# EAGLE design UBW32_MX460_v262 (EAGLE 7.7.0)
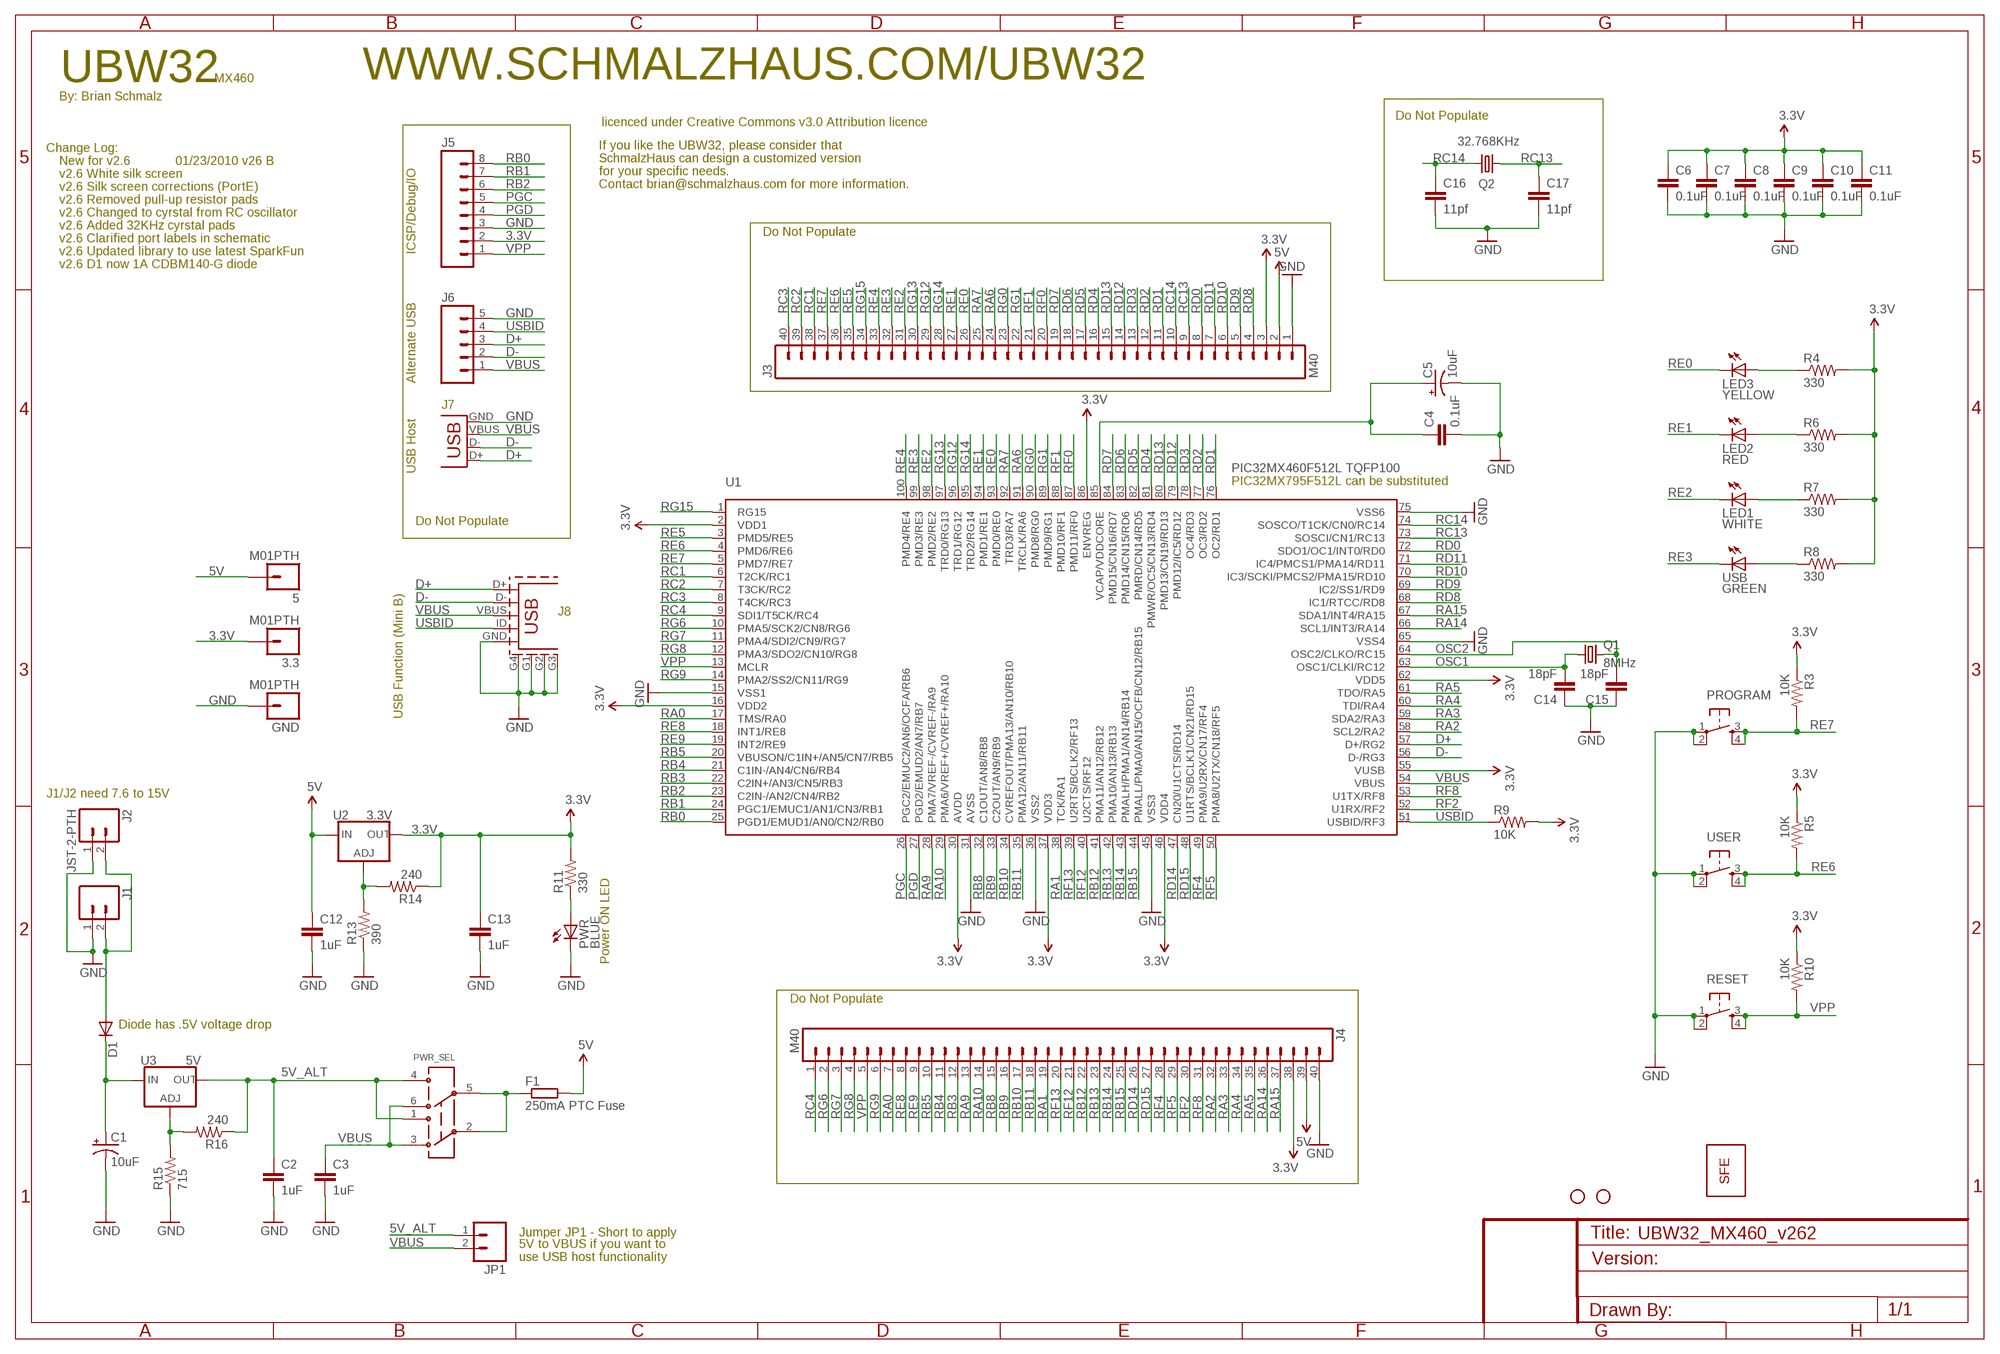
[diagram p0: schematic, sheet 1]

## Parts
3.3  M01PTH  [1X01]
5  M01PTH  [1X01]
C1  10uF  CAP_POL3528  [EIA3528]
C2  1uF  CAP0402-CAP  [0402-CAP]
C3  1uF  CAP0402-CAP  [0402-CAP]
C4  0.1uF  CAP0402-CAP  [0402-CAP]
C5  10uF  CAP_POL3528  [EIA3528]
C6  0.1uF  CAP0402-CAP  [0402-CAP]
C7  0.1uF  CAP0402-CAP  [0402-CAP]
C8  0.1uF  CAP0402-CAP  [0402-CAP]
C9  0.1uF  CAP0402-CAP  [0402-CAP]
C10  0.1uF  CAP0402  [C0402]
C11  0.1uF  CAP0402-CAP  [0402-CAP]
C12  1uF  CAP0402  [C0402]
C13  1uF  CAP0402  [C0402]
C14  18pF  CAP0402-CAP  [0402-CAP]
C15  18pF  CAP0402-CAP  [0402-CAP]
C16  11pf  CAP0402-CAP  [0402-CAP]
C17  11pf  CAP0402-CAP  [0402-CAP]
D1  DIODESMA  [SMA-DIODE]
F1  250mA PTC Fuse  R-EU_R1206  [R1206]
GND  M01PTH  [1X01]
J1  M02PTH  [1X02]
J2  JST-2-PTH  M02-JST-2MM-SMT  [S2B-PH]
J3  M40  [1X40]
J4  M40  [1X40]
J5  M08  [1X08]
J6  M05PTH  [1X05]
J7  USB-A-S  [USB-A-S]
J8  USB-MINIB  USB_5PIN  [USB-MINIB]
JP1  M02PTH  [1X02]
LED1  WHITE  LED0603  [LED-0603]
LED2  RED  LED0603  [LED-0603]
LED3  YELLOW  LED0603  [LED-0603]
PROGRAM  TAC_SWITCHSND  [TACTILE_SWITCH_SMD]
PWR  BLUE  LED0603  [LED-0603]
PWR_SEL  AYZ0202  [AYZ0202]
Q1  8MHz  CRYSTAL5X3  [CRYSTAL-SMD-5X3]
Q2  32.768KHz  CRYSTAL32-SMD  [CRYSTAL-32KHZ-SMD]
R3  10K  RESISTOR0402-RES  [0402-RES]
R4  330  RESISTOR0402-RES  [0402-RES]
R5  10K  RESISTOR0402-RES  [0402-RES]
R6  330  RESISTOR0402-RES  [0402-RES]
R7  330  RESISTOR0402-RES  [0402-RES]
R8  330  RESISTOR0402-RES  [0402-RES]
R9  10K  RESISTOR0402-RES  [0402-RES]
R10  10K  RESISTOR0402-RES  [0402-RES]
R11  330  RESISTOR0402-RES  [0402-RES]
R13  390  RESISTOR0402-RES  [0402-RES]
R14  240  RESISTOR0402-RES  [0402-RES]
R15  715  RESISTOR0402-RES  [0402-RES]
R16  240  RESISTOR0402-RES  [0402-RES]
RESET  TAC_SWITCHSND  [TACTILE_SWITCH_SMD]
U1  PIC32MX460F512L TQFP100  PIC32MX4XXLTQFP100  [TQFP100]
U2  3.3V  V_REG_317SMD  [SOT223]
U3  5V  V_REG_317SMD  [SOT223]
U$4  LOGO-SFENEW  [SFE-NEW-WEBLOGO]
U$6  STAND-OFF  [STAND-OFF]
U$7  STAND-OFF  [STAND-OFF]
USB  GREEN  LED0603  [LED-0603]
USER  TAC_SWITCHSND  [TACTILE_SWITCH_SMD]

## Nets
3.3V: 3.3.1 C6.1 C7.1 C8.1 C9.1 C10.1 C11.1 C13.1 J3.3 J4.38 J5.2 R3.1 R4.2 R5.1 R6.2 R7.2 R8.2 R9.2 R10.1 R11.2 R14.1 U1.2(VDD1) U1.16(VDD2) U1.30(AVDD) U1.37(VDD3) U1.46(VDD4) U1.55(VUSB) U1.62(VDD5) U1.86(ENVREG) U2.2(OUT)
5V: 5.1 C12.1 F1.2 J3.2 J4.39 U2.3(IN)
5V_ALT: C2.1 JP1.1 PWR_SEL.1 PWR_SEL.4 R16.1 U3.2(OUT)
D+: J6.3 J7.D+ J8.D+ U1.57(D+/RG2)
D-: J6.2 J7.D- J8.D- U1.56(D-/RG3)
GND: C1.C(-) C2.2 C3.2 C4.2 C5.C(-) C6.2 C7.2 C8.2 C9.2 C10.2 C11.2 C12.2 C13.2 C14.1 C15.1 C16.2 C17.2 GND.1 J1.1 J2.1 J3.1 J4.40 J5.3 J6.5 J7.GND J8.G1 J8.G2 J8.G3 J8.G4(SHIELD) J8.GND PROGRAM.1 PROGRAM.2 PWR.C R13.1 R15.1 RESET.1 RESET.2 U1.15(VSS1) U1.31(AVSS) U1.36(VSS2) U1.45(VSS3) U1.65(VSS4) U1.75(VSS6) USER.1 USER.2
N$1: D1.A J1.2 J2.2
N$2: F1.1 PWR_SEL.2 PWR_SEL.5
N$3: R13.2 R14.2 U2.1(ADJ)
N$4: R15.2 R16.2 U3.1(ADJ)
N$6: PWR.A R11.1
N$20: R8.1 USB.A
N$22: LED1.A R7.1
N$23: LED2.A R6.1
N$35: LED3.A R4.1
N$110: C4.1 C5.A(+) U1.85(VCAP/VDDCORE)
OSC1: C14.2 Q1.1 U1.63(OSC1/CLKI/RC12)
OSC2: C15.2 Q1.3 U1.64(OSC2/CLKO/RC15)
PGC: J5.5 U1.26(PGC2/EMUC2/AN6/OCFA/RB6)
PGD: J5.4 U1.27(PGD2/EMUD2/AN7/RB7)
RA0: J4.7 U1.17(TMS/RA0)
RA1: J4.19 U1.38(TCK/RA1)
RA2: J4.32 U1.58(SCL2/RA2)
RA3: J4.33 U1.59(SDA2/RA3)
RA4: J4.34 U1.60(TDI/RA4)
RA5: J4.35 U1.61(TDO/RA5)
RA6: J3.24 U1.91(TRCLK/RA6)
RA7: J3.25 U1.92(TRD3/RA7)
RA9: J4.13 U1.28(PMA7/VREF-/CVREF-/RA9)
RA10: J4.14 U1.29(PMA6/VREF+/CVREF+/RA10)
RA14: J4.36 U1.66(SCL1/INT3/RA14)
RA15: J4.37 U1.67(SDA1/INT4/RA15)
RB0: J5.8 U1.25(PGD1/EMUD1/AN0/CN2/RB0)
RB1: J5.7 U1.24(PGC1/EMUC1/AN1/CN3/RB1)
RB2: J5.6 U1.23(C2IN-/AN2/CN4/RB2)
RB3: J4.12 U1.22(C2IN+/AN3/CN5/RB3)
RB4: J4.11 U1.21(C1IN-/AN4/CN6/RB4)
RB5: J4.10 U1.20(VBUSON/C1IN+/AN5/CN7/RB5)
RB8: J4.15 U1.32(C1OUT/AN8/RB8)
RB9: J4.16 U1.33(C2OUT/AN9/RB9)
RB10: J4.17 U1.34(CVREFOUT/PMA13/AN10/RB10)
RB11: J4.18 U1.35(PMA12/AN11/RB11)
RB12: J4.22 U1.41(PMA11/AN12/RB12)
RB13: J4.23 U1.42(PMA10/AN13/RB13)
RB14: J4.24 U1.43(PMALH/PMA1/AN14/RB14)
RB15: J4.25 U1.44(PMALL/PMA0/AN15/OCFB/CN12/RB15)
RC1: J3.38 U1.6(T2CK/RC1)
RC2: J3.39 U1.7(T3CK/RC2)
RC3: J3.40 U1.8(T4CK/RC3)
RC4: J4.1 U1.9(SDI1/T5CK/RC4)
RC13: C17.1 J3.9 Q2.X1 U1.73(SOSCI/CN1/RC13)
RC14: C16.1 J3.10 Q2.X2 U1.74(SOSCO/T1CK/CN0/RC14)
RD0: J3.8 U1.72(SDO1/OC1/INT0/RD0)
RD1: J3.11 U1.76(OC2/RD1)
RD2: J3.12 U1.77(OC3/RD2)
RD3: J3.13 U1.78(OC4/RD3)
RD4: J3.16 U1.81(PMWR/OC5/CN13/RD4)
RD5: J3.17 U1.82(PMRD/CN14/RD5)
RD6: J3.18 U1.83(PMD14/CN15/RD6)
RD7: J3.19 U1.84(PMD15/CN16/RD7)
RD8: J3.4 U1.68(IC1/RTCC/RD8)
RD9: J3.5 U1.69(IC2/SS1/RD9)
RD10: J3.6 U1.70(IC3/SCKI/PMCS2/PMA15/RD10)
RD11: J3.7 U1.71(IC4/PMCS1/PMA14/RD11)
RD12: J3.14 U1.79(PMD12/IC5/RD12)
RD13: J3.15 U1.80(PMD13/CN19/RD13)
RD14: J4.26 U1.47(CN20/U1CTS/RD14)
RD15: J4.27 U1.48(U1RTS/BCLK1/CN21/RD15)
RE0: J3.26 LED3.C U1.93(PMD0/RE0)
RE1: J3.27 LED2.C U1.94(PMD1/RE1)
RE2: J3.31 LED1.C U1.98(PMD2/RE2)
RE3: J3.32 U1.99(PMD3/RE3) USB.C
RE4: J3.33 U1.100(PMD4/RE4)
RE5: J3.35 U1.3(PMD5/RE5)
RE6: J3.36 R5.2 U1.4(PMD6/RE6) USER.3 USER.4
RE7: J3.37 PROGRAM.3 PROGRAM.4 R3.2 U1.5(PMD7/RE7)
RE8: J4.8 U1.18(INT1/RE8)
RE9: J4.9 U1.19(INT2/RE9)
RF0: J3.20 U1.87(PMD11/RF0)
RF1: J3.21 U1.88(PMD10/RF1)
RF2: J4.30 U1.52(U1RX/RF2)
RF4: J4.28 U1.49(PMA9/U2RX/CN17/RF4)
RF5: J4.29 U1.50(PMA8/U2TX/CN18/RF5)
RF8: J4.31 U1.53(U1TX/RF8)
RF12: J4.21 U1.40(U2CTS/RF12)
RF13: J4.20 U1.39(U2RTS/BCLK2/RF13)
RG0: J3.23 U1.90(PMD8/RG0)
RG1: J3.22 U1.89(PMD9/RG1)
RG6: J4.2 U1.10(PMA5/SCK2/CN8/RG6)
RG7: J4.3 U1.11(PMA4/SDI2/CN9/RG7)
RG8: J4.4 U1.12(PMA3/SDO2/CN10/RG8)
RG9: J4.6 U1.14(PMA2/SS2/CN11/RG9)
RG12: J3.29 U1.96(TRD1/RG12)
RG13: J3.30 U1.97(TRD0/RG13)
RG14: J3.28 U1.95(TRD2/RG14)
RG15: J3.34 U1.1(RG15)
USBID: J6.4 J8.ID(USB_ID) R9.1 U1.51(USBID/RF3)
VBUS: C3.1 J6.1 J7.VBUS J8.VBUS JP1.2 PWR_SEL.3 PWR_SEL.6 U1.54(VBUS)
VIN_RAW: C1.A(+) D1.C U3.3(IN)
VPP: J4.5 J5.1 R10.2 RESET.3 RESET.4 U1.13(MCLR)

## Notes on the sheet
- UBW32 | MX460 | WWW.SCHMALZHAUS.COM/UBW32
- By: Brian Schmalz
- Do Not Populate
- licenced under Creative Commons v3.0 Attribution licence
- Change Log: | If you like the UBW32, please consider that
- New for v2.6 | 01/23/2010 v26 B | SchmalzHaus can design a customized version
- v2.6 White silk screen | for your specific needs.
- v2.6 Silk screen corrections (PortE) | Contact brian@schmalzhaus.com for more information.
- v2.6 Removed pull-up resistor pads
- v2.6 Changed to cyrstal from RC oscillator
- v2.6 Added 32KHz cyrstal pads
- Do Not Populate
- v2.6 Clarified port labels in schematic
- v2.6 Updated library to use latest SparkFun | ICSP/Debug/IO
- v2.6 D1 now 1A CDBM140-G diode
- Alternate USB
- J7
- USB Host
- PIC32MX795F512L can be substituted
- Do Not Populate
- J8
- USB Function (Mini B)
- J1/J2 need 7.6 to 15V
- Power ON LED
- Do Not Populate
- Diode has .5V voltage drop
- Jumper JP1 - Short to apply
- 5V to VBUS if you want to
- use USB host functionality

## Library data of the parts
3.3 5 GND = SparkFun-12-01-09:M01: Header 1 Standard 1-pin 0.1" header. Use with straight break away headers (SKU : PRT-00116), right angle break away headers (PRT-00553), swiss pins (PRT-00743), machine pins (PRT-00117), and female headers (PRT-00115).
C1 C5 = SparkFun02-20-08:CAP_POL: Capacitor Polarized These are standard SMD and PTH capacitors. Normally 10uF, 47uF, and 100uF in electrolytic and tantalum varieties. Always verify the external diameter of the through hole cap, it varies with capacity, voltage, and manufacturer. The EIA devices should be standard.
C2-C4 C6-C9 C11 C14-C17 = SparkFun:CAP: Capacitor Standard 0603 ceramic capacitor, and 0.1" leaded capacitor.
C10 C12 C13 = SparkFun02-20-08:CAP: Capacitor Standard 0603 ceramic capacitor, and 0.1" leaded capacitor.
D1 = SparkFun-12-01-09:DIODE: Diode These are standard reverse protection diodes and small signal diodes. SMA package can handle up to about 1A. SOD-323 can handle about 200mA. What the SOD-323 package when ordering, there are some mfgs out there that are 5-pin packages.
F1 = resistor:R-EU_: RESISTOR, European symbol
J1 JP1 = SparkFun-12-01-09:M02: Header 2 Standard 2-pin 0.1" header. Use with straight break away headers (SKU : PRT-00116), right angle break away headers (PRT-00553), swiss pins (PRT-00743), machine pins (PRT-00117), and female headers (PRT-00115). Molex polarized connector foot print use with SKU : PRT-08233 with associated crimp pins and housings.
J2 = SparkFun:M02: Header 2 Standard 2-pin 0.1" header. Use with straight break away headers (SKU : PRT-00116), right angle break away headers (PRT-00553), swiss pins (PRT-00743), machine pins (PRT-00117), and female headers (PRT-00115). Molex polarized connector foot print use with SKU : PRT-08233 with associated crimp pins and housings.
J3 J4 = SchmalzHaus:M40
J5 = SchmalzHaus:M08: Header 8 Standard 8-pin 0.1" header. Use with straight break away headers (SKU : PRT-00116), right angle break away headers (PRT-00553), swiss pins (PRT-00743), machine pins (PRT-00117), and female headers (PRT-00115).
J6 = SparkFun-12-01-09:M05: Header 5 Standard 5-pin 0.1" header. Use with straight break away headers (SKU : PRT-00116), right angle break away headers (PRT-00553), swiss pins (PRT-00743), machine pins (PRT-00117), and female headers (PRT-00115). Molex polarized connector foot print use with SKU : PRT-08230 with associated crimp pins and housings.
J7 = SparkFun02-20-08:USB: USB Connectors USB-B-PTH is fully proven SKU : PRT-00139 USB-miniB is fully proven SKU : PRT-00587 USB-A-PCB is untested. USB-A-H is throughly reviewed, but untested. Spark Fun Electronics SKU : PRT-00437 USB-B-SMT is throughly reviewed, but untested. Needs silkscreen touching up. USB-A-S has not been used/tested USB-MB-H has not been used/tested
J8 = SparkFun02-20-08:USB_5PIN
LED1-LED3 PWR USB = SparkFun:LED: LEDs Standard schematic elements and footprints for 5mm, 3mm, 1206, and 0603 sized LEDs. 5mm - Spark Fun Electronics SKU : COM-00529 (and others)
PROGRAM RESET USER = SparkFun02-20-08:TAC_SWITCH: Momentary Switch Button commonly used for reset or general input. Spark Fun Electronics SKU : COM-00097
PWR_SEL = SparkFun02-20-08:AYZ0202: SPDT Slide Switch Simple SMD single-pull double-throw slide switch. Good for less than 350mA power switch, switching UARTs between devices, etc. Spark Fun Electronics SKU : COM-00597
Q1 = SparkFun11_03_09:CRYSTAL: Crystals Various standard crystals. Proven footprints. Spark Fun Electronics SKU : COM-00534
Q2 = SchmalzHaus:CRYSTAL: Crystals Various standard crystals. Proven footprints. Spark Fun Electronics SKU : COM-00534
R3-R11 R13-R16 = SparkFun:RESISTOR: Resistor Basic schematic elements and footprints for 0603, 1206, and PTH 1/10th watt (small) resistors.
U1 = SchmalzHaus:PIC32MX4XXL
U2 U3 = SparkFun:V_REG_317: Voltage Regulator Standard LM317 adjustable voltage regulator. AOI (Adjust Output Input). Google 'LM317 Calculator' for easy to use app to get the two resistor values needed. 240/720 for 5V output. 240/390 for 3.3V output. Spark Fun Electronics SKU : COM-00527
U$4 = SparkFun02-20-08:LOGO-SFE: Spark Fun Electronics PCB Logo This is the standard Spark Fun Electronics PCB logo.
U$6 U$7 = SparkFun02-20-08:STAND-OFF: Stand Off This is the mechanical footprint for a #4 phillips button head screw. Use the keepout ring to avoid running the screw head into surrounding components. SKU : PRT-00447

## Board
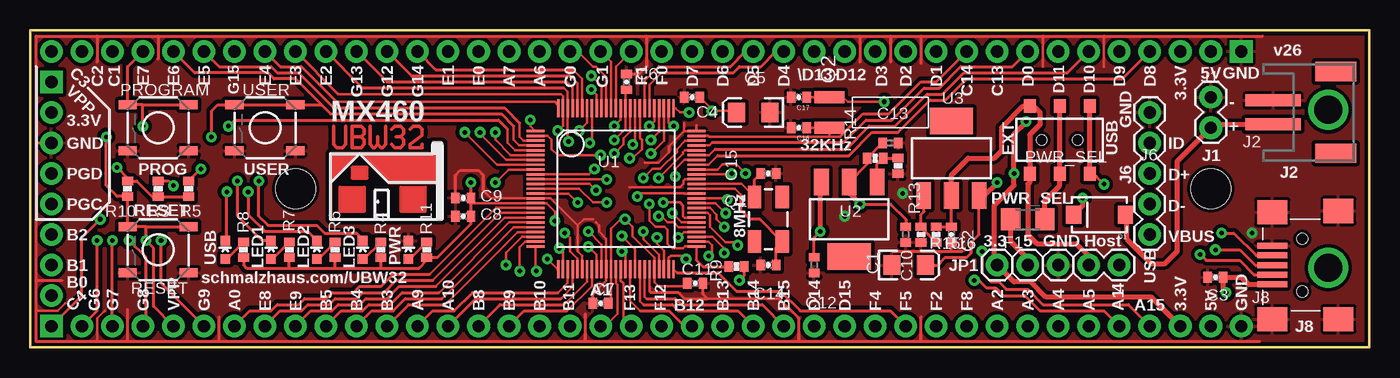
[diagram p1: board, top side]
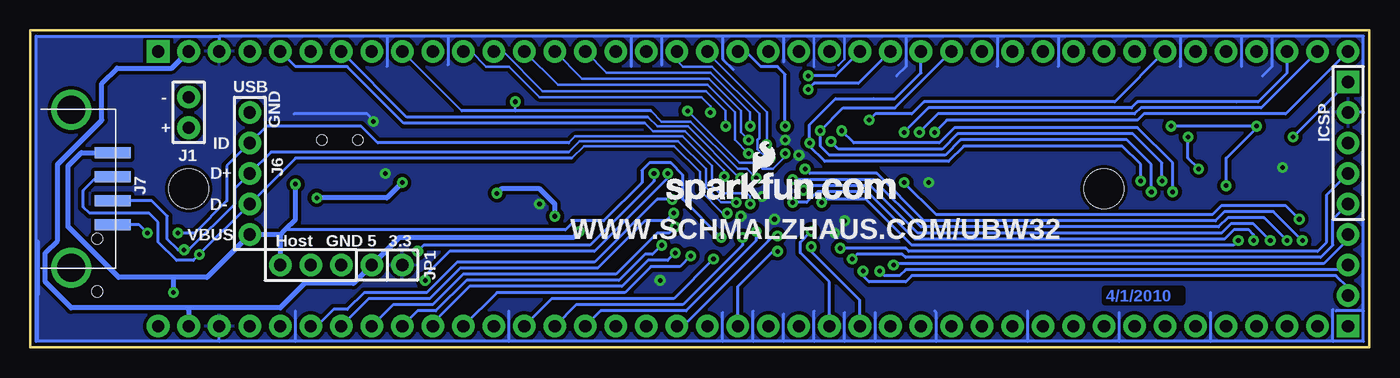
[diagram p2: board, bottom side, seen from below]

Size 111.51 x 26.42 mm. Coordinates in mm from the lower left corner, seen from the top.
Outline: 0,26.42 111.51,26.42 111.51,0 0,0 0,26.42
Copper layers (1*16): Top 0.035mm / dielectric 1.5mm / Bottom 0.035mm
Design rules "SparkFun *": minimum track width 8mil, minimum drill 15mil, track to track 8mil, track to pad 8mil, pad to pad 8mil, via to via 8mil, smd to smd 8mil, copper to edge 8mil, drill to drill 8mil, minimum pad ring 12mil, minimum via ring 10mil, stop-mask expansion 4mil, vias tented up to drill 20mil, thermal gap 10mil

### Footprints (pad centres in the part's own frame; a part is rotated, then mirrored left to right if it is on the bottom)
1X01 = drill 1.016 pad 1.88: 1 0,0
EIA3216 = smd 1.4 x 1.6: A 1.4,0; C -1.4,0
0402-CAP = smd 0.7 x 0.9: 1 -0.65,0; 2 0.65,0
C0402 = smd 0.7 x 0.9: 1 -0.65,0; 2 0.65,0
SMA-DIODE = smd 1.27 x 1.47: A -2.15,0; C 2.15,0
R1206 = smd 1.6 x 1.803: 1 -1.422,0; 2 1.422,0
1X02 = drill 1.016 pad 1.88: 1 0,0; 2 2.54,0
S2B-PH = smd 1 x 4.6: 1 -1,-3.7; 2 1,-3.7 | smd 1.6 x 3.4: NC1 -3.4,1.5; NC2 3.4,1.5
1X40 = drill 1.016 pad 1.88 square: 1 -49.53,0 | drill 1.016 pad 1.88: 2 -46.99,0; 3 -44.45,0; 4 -41.91,0; 5 -39.37,0; 6 -36.83,0; 7 -34.29,0; 8 -31.75,0; 9 -29.21,0; 10 -26.67,0; 11 -24.13,0; 12 -21.59,0; 13 -19.05,0; 14 -16.51,0; 15 -13.97,0; 16 -11.43,0; 17 -8.89,0; 18 -6.35,0; 19 -3.81,0; 20 -1.27,0; 21 1.27,0; 22 3.81,0; 23 6.35,0; 24 8.89,0; 25 11.43,0; 26 13.97,0; 27 16.51,0; 28 19.05,0; 29 21.59,0; 30 24.13,0; 31 26.67,0; 32 29.21,0; 33 31.75,0; 34 34.29,0; 35 36.83,0; 36 39.37,0; 37 41.91,0; 38 44.45,0; 39 46.99,0; 40 49.53,0
1X08 = drill 1.016 pad 1.88 square: 1 0,0 | drill 1.016 pad 1.88: 2 2.54,0; 3 5.08,0; 4 7.62,0; 5 10.16,0; 6 12.7,0; 7 15.24,0; 8 17.78,0
1X05 = drill 1.016 pad 1.88: 1 0,0; 2 2.54,0; 3 5.08,0; 4 7.62,0; 5 10.16,0
USB-A-S = smd 3 x 0.9: D+ 3.45,-1; D- 3.45,1; GND 3.45,-3; VBUS 3.45,3 | drill 2.311: P$5 0,-6.566; P$6 0,6.566
USB-MINIB = smd 2.5 x 0.5: D+ 2.5,0; D- 2.5,0.8; GND 2.5,-1.6; ID 2.5,-0.8; VBUS 2.5,1.6 | smd 2.5 x 2: G1 -3,4.5; G2 2.5,4.5; G3 -3,-4.5; G4 2.5,-4.4 | hole 0.9: 0,2.2; 0,-2.2
LED-0603 = smd 0.8 x 0.8: A 0,-0.75; C 0,0.75
TACTILE_SWITCH_SMD = smd 1.524 x 0.762: 1 -2.54,1.905; 2 2.54,1.905; 3 -2.54,-1.905; 4 2.54,-1.905
AYZ0202 = smd 1 x 1.15: 1 -2.5,2.825; 2 0,2.825; 3 2.5,2.825; 4 -2.5,-2.825; 5 0,-2.825; 6 2.5,-2.825 | hole 0.85: 1.5,0; -1.5,0
CRYSTAL-SMD-5X3 = smd 1.9 x 1.1: 1 -1.85,-1.15; 2 1.85,-1.15; 3 1.85,1.15; 4 -1.85,1.15
CRYSTAL-32KHZ-SMD = smd 1 x 2.5: X1 -1.27,0; X2 1.27,0
0402-RES = smd 0.7 x 0.9: 1 -0.65,0; 2 0.65,0
TQFP100 = smd 0.2 x 1.5: 1 -4.8,-6.7; 2 -4.4,-6.7; 3 -4,-6.7; 4 -3.6,-6.7; 5 -3.2,-6.7; 6 -2.8,-6.7; 7 -2.4,-6.7; 8 -2,-6.7; 9 -1.6,-6.7; 10 -1.2,-6.7; 11 -0.8,-6.7; 12 -0.4,-6.7; 13 0,-6.7; 14 0.4,-6.7; 15 0.8,-6.7; 16 1.2,-6.7; 17 1.6,-6.7; 18 2,-6.7; 19 2.4,-6.7; 20 2.8,-6.7; 21 3.2,-6.7; 22 3.6,-6.7; 23 4,-6.7; 24 4.4,-6.7; 25 4.8,-6.7; 51 4.8,6.7; 52 4.4,6.7; 53 4,6.7; 54 3.6,6.7; 55 3.2,6.7; 56 2.8,6.7; 57 2.4,6.7; 58 2,6.7; 59 1.6,6.7; 60 1.2,6.7; 61 0.8,6.7; 62 0.4,6.7; 63 0,6.7; 64 -0.4,6.7; 65 -0.8,6.7; 66 -1.2,6.7; 67 -1.6,6.7; 68 -2,6.7; 69 -2.4,6.7; 70 -2.8,6.7; 71 -3.2,6.7; 72 -3.6,6.7; 73 -4,6.7; 74 -4.4,6.7; 75 -4.8,6.7 | smd 1.5 x 0.2: 26 6.7,-4.8; 27 6.7,-4.4; 28 6.7,-4; 29 6.7,-3.6; 30 6.7,-3.2; 31 6.7,-2.8; 32 6.7,-2.4; 33 6.7,-2; 34 6.7,-1.6; 35 6.7,-1.2; 36 6.7,-0.8; 37 6.7,-0.4; 38 6.7,0; 39 6.7,0.4; 40 6.7,0.8; 41 6.7,1.2; 42 6.7,1.6; 43 6.7,2; 44 6.7,2.4; 45 6.7,2.8; 46 6.7,3.2; 47 6.7,3.6; 48 6.7,4; 49 6.7,4.4; 50 6.7,4.8; 76 -6.7,4.8; 77 -6.7,4.4; 78 -6.7,4; 79 -6.7,3.6; 80 -6.7,3.2; 81 -6.7,2.8; 82 -6.7,2.4; 83 -6.7,2; 84 -6.7,1.6; 85 -6.7,1.2; 86 -6.7,0.8; 87 -6.7,0.4; 88 -6.7,0; 89 -6.7,-0.4; 90 -6.7,-0.8; 91 -6.7,-1.2; 92 -6.7,-1.6; 93 -6.7,-2; 94 -6.7,-2.4; 95 -6.7,-2.8; 96 -6.7,-3.2; 97 -6.7,-3.6; 98 -6.7,-4; 99 -6.7,-4.4; 100 -6.7,-4.8
SOT223 = smd 1.219 x 2.235: 1 -2.311,-3.099; 2 0,-3.099; 3 2.311,-3.099 | smd 3.6 x 2.2: 4 0,3.099
STAND-OFF = hole 3.302: 0,0

### Placement (x,y rotation side)
3.3  80.52,6.86 0 top
5  83.06,6.86 0 top
C1  10uF  [EIA3216]  73.15,6.86 0 top
C2  76.71,9.4 270 top
C3  98.68,5.84 180 top
C4  55.12,20.83 180 top
C5  10uF  [EIA3216]  60.2,19.56 180 top
C6  49.66,22.1 90 top
C7  47.5,3.68 180 top
C8  36.07,10.92 180 top
C9  36.07,12.45 180 top
C10  72.9,9.4 270 top
C11  55.37,5.33 0 top
C12  65.28,6.86 270 top
C13  71.63,17.02 0 top
C14  61.47,6.86 0 top
C15  61.47,14.48 180 top
C16  64.01,18.29 180 top
C17  64.01,20.83 180 top
D1  89.03,11.05 180 top
F1  83.06,10.67 180 top
GND  85.6,6.86 0 top
J1  98.3,20.83 270 top
J2  107.19,19.56 270 top
J3  51.31,24.64 180 top
J4  51.31,1.78 0 top
J5  1.78,22.1 270 top
J6  93.22,9.4 90 top
J7  108.08,13.21 0 bottom
J8  105.92,6.86 180 top
JP1  88.14,6.86 0 top
LED1  20.07,8.13 0 top
LED2  23.88,8.13 0 top
LED3  27.69,8.13 0 top
PROGRAM  10.67,18.29 180 top
PWR  31.5,8.13 0 top
PWR_SEL  85.72,17.27 0 top
Q1  61.47,10.67 90 top
Q2  66.55,19.56 270 top
R3  10.67,13.21 90 top
R4  29.21,8.13 270 top
R5  13.21,13.21 90 top
R6  25.4,8.13 270 top
R7  21.59,8.13 270 top
R8  17.78,8.13 270 top
R9  58.8,6.73 0 top
R10  8.13,13.21 270 top
R11  33.02,8.13 270 top
R13  72.26,15.11 90 top
R14  70.36,15.75 0 top
R15  74.17,9.4 90 top
R16  75.44,9.4 270 top
RESET  10.67,8.13 180 top
U1  48.77,13.21 270 top
U2  68.2,10.67 180 top
U3  76.71,15.75 0 top
U$3  [UBW32]  29.59,17.91 0 top
U$4  58.55,11.43 0 bottom
U$5  [SCHMALZHAUS]  28.83,13.21 0 top
U$6  98.3,13.21 0 top
U$7  22.1,13.21 0 top
USB  16.26,8.13 0 top
USER  19.56,18.29 180 top

### Tracks (layer width: path | path; a pad name or v marks a point on that pad's centre or on a via)
3.3V  (via drill 0.38)
  Top 0.203: v48.64,17.27 49.57,18.2 U1.86 49.57,21.36 arc-90 C6.1 | v43.69,10.54 43.69,11.3 42.98,12.01 U1.16 36.77,12.01 | v44.51,9.52 44.58,9.52 44.96,9.14 44.96,8 45.57,7.39 U1.30 | U1.2 43.1,17.61 43.43,17.27 43.43,16.51 43.94,16 v47.5,16 | 48.37,3.92 U1.37 48.37,9.89 49.15,10.67 v49.53,10.67 50.16,10.03 50.16,9.27 51.97,7.47 U1.46 51.97,5.44 52.32,5.08 54.48,5.08 54.74,5.33 C11.1 | U1.62 54.5,12.81 54.48,12.83 50.8,12.83 v50.55,12.57 | U1.55 54,10.01 53.59,10.41 53.09,10.41 52.58,10.92 v52.32,10.92
  Top 0.254: v36.7,13.72 36.72,13.7 C9.1 36.7,12.45 36.7,11.94 | 36.7,10.92 C8.1 | 36.7,10.92 36.7,11.94 | 36.7,11.94 36.77,12.01 | 36.7,10.92 36.7,10.29 33.91,7.49 33.02,7.49 R11.2 33.02,7.24 32.38,6.6 29.21,6.6 | 21.59,6.6 25.4,6.6 | 25.4,6.6 29.21,6.6 | 29.21,6.6 R4.2 | 25.4,6.6 R6.2 | 21.59,6.6 R7.2 | R8.2 17.78,6.87 18.05,6.6 21.59,6.6 | C7.1 48.13,3.68 48.37,3.92 | R5.1 R3.1 10.18,12.56 8.89,13.84 8.14,13.84 R10.1 8.13,14.1 v7.24,14.99 | C13.1 R14.1 69.71,15.28 U2.2 | 72.88,10.03 C10.1 72.9,10.67 71.63,11.94 v69.09,11.94 | R9.2 59.45,5.98 v59.05,5.59
  Top 0.406: J4.38 93.34,4.19 84.58,4.19 83.31,5.46 81.91,5.46 3.3.1 80.26,7.11 80.26,11.81 81.91,13.46 v81.91,14.48 81.91,17.78 v82.93,18.8 | v69.09,11.94 68.2,12.83 U2.2
  Bottom 0.203: 43.69,25.91 43.69,24 44.2,23.49 | 46.23,25.91 46.23,23.37
  Bottom 0.254: 89.53,19.43 83.44,19.43 82.93,18.92 v82.93,18.8 | 0.51,3.05 0.51,0.51 3.05,0.51 | 0.51,3.05 0.51,19.56 | 0.51,19.56 0.51,25.91 8.13,25.91 | 8.13,25.91 10.67,25.91 | 10.67,25.91 15.75,25.91 | 15.75,25.91 25.91,25.91 | 25.91,25.91 30.99,25.91 | 30.99,25.91 38.61,25.91 | 38.61,25.91 43.69,25.91 46.23,25.91 48.77,25.91 | 48.77,25.91 53.85,25.91 | 81.79,25.91 95.76,25.91 | 76.71,25.91 81.79,25.91 | 61.47,25.91 76.71,25.91 | 58.93,25.91 61.47,25.91 | 53.85,25.91 58.93,25.91 | 95.76,25.91 111,25.91 111,0.51 | 3.05,0.51 13.21,0.51 | 13.21,0.51 20.83,0.51 | 20.83,0.51 28.45,0.51 | 28.45,0.51 36.07,0.51 | 36.07,0.51 41.15,0.51 | 41.15,0.51 43.69,0.51 | 43.69,0.51 46.23,0.51 | 46.23,0.51 48.77,0.51 | 48.77,0.51 51.31,0.51 | 51.31,0.51 53.85,0.51 | 53.85,0.51 71.63,0.51 | 71.63,0.51 89.41,0.51 | 89.41,0.51 95.76,0.51 | 95.76,0.51 111,0.51 | 0.51,19.56 2.03,19.56 | 0.51,3.05 2.79,3.05 | 3.05,0.51 3.05,3.17 | 41.15,0.51 41.15,2.92 | 48.77,0.51 48.77,2.79 | 53.85,25.91 53.85,24 52.96,23.11 | 95.76,25.91 95.76,24.13 | 95.76,0.51 J4.38 | 89.41,0.51 89.41,3.05 | 25.91,25.91 25.91,23.37 | 30.99,25.91 30.99,23.37 | 48.77,25.91 48.77,23.75 | 38.61,25.91 38.61,23.37 39.37,22.61 | 15.75,25.91 15.75,23.37 | 10.67,25.91 10.67,23.37 | 8.13,25.91 8.13,23.37 8.89,22.61 | 13.21,0.51 13.21,2.92 | 20.83,0.51 20.83,2.92 | 28.45,0.51 28.45,3.05 | 36.07,0.51 36.07,2.92 36.2,3.05 | 43.69,0.51 43.69,2.92 | 53.85,0.51 53.85,2.92 | 51.31,0.51 51.31,3.05 | 46.23,0.51 46.23,3.05 | 71.63,0.51 71.63,3.05 | 76.71,25.91 76.71,23.49 | 81.79,25.91 81.79,23.37 | 58.93,25.91 58.93,23.49 | 61.47,25.91 61.47,23.37 | 110.87,4.45 110.87,0.64 111,0.51
  Bottom 0.406: 110.87,4.45 110.87,8.76
  pour Bottom (isolate 0.305): 0.51,0.51 0.51,25.91 111,25.91 111,0.51
5V  (via drill 0.38)
  Top 0.254: C12.1 65.28,9.14 v65.79,9.65
  Top 0.406: F1.2 81.64,8.79 83.06,7.37 5.1 | U2.3 65.79,13.66 v65.79,9.65
  Bottom 0.254: 98.42,3.3 98.3,3.17
  Bottom 0.406: v65.79,9.65 66.29,9.14 80.77,9.14 5.1 84.58,5.33 88.65,5.33 90.68,3.3 98.42,3.3 108.08,3.3 110.24,5.46 110.24,7.87 109.22,8.89 109.22,15.24 105.54,18.92 105.54,21.97 104.27,23.24 99.69,23.24 J3.2 | 98.3,3.17 J4.39
5V_ALT
  Top 0.254: 76.71,12.57 U3.2 C2.1 R16.1
  Top 0.406: JP1.1 88.14,7.62 87.12,8.64 83.82,8.64 83.06,9.4 83.06,13.59 83.22,13.76 PWR_SEL.4 83.22,17.69 84.07,18.54 84.07,19.56 83.53,20.1 PWR_SEL.1 82.71,20.1 80.9,18.29 80.9,16.38 80.26,15.75 78.1,15.75 76.71,14.35 U3.2
D+  (via drill 0.38)
  Top 0.203: U1.57 54.47,10.81 54.36,10.92 54.36,11.81 54.1,12.07 v52.71,12.07
  Top 0.254: J8.D+ 101.98,6.86 100.71,8.13 v98.68,8.13
  Bottom 0.203: 66.67,16.26 65.76,17.17 57.56,17.17 55.25,14.86 55.25,13.34 53.98,12.07 v52.71,12.07
  Bottom 0.254: 66.67,16.26 91.44,16.26 J6.3 94.49,13.21 94.49,11.94 98.3,8.13 v98.68,8.13 99.19,8.13 100.08,9.02 100.08,10.92 101.36,12.21 J7.D+
D-  (via drill 0.38)
  Top 0.203: U1.56 54.23,10.41 v53.47,11.18
  Top 0.254: v97.41,7.75 97.92,7.24 100.71,7.24 101.89,6.06 J8.D-
  Bottom 0.203: 66.42,15.75 65.41,16.76 61.47,16.76 57.91,16.76 55.75,14.61 55.75,13.08 53.85,11.18 v53.47,11.18
  Bottom 0.254: 66.42,15.75 89.41,15.75 J6.2 v97.41,7.75 97.92,7.24 99.31,7.24 100.84,8.76 100.84,10.41 101.6,11.18 106.55,11.18 107.06,11.68 107.06,13.08 105.93,14.21 J7.D-
GND  (via drill 0.38)
  Top 0.203: 38.1,12.7 38.39,12.41 U1.15 43.35,12.41 45.59,10.16 | 46.86,4.45 47.97,5.55 U1.36 47.97,9.05 47.37,9.65 47.37,10.16 47.12,10.41 | 54.46,18.01 53.21,16.76 53.21,16.26 52.32,15.37 51.18,15.37 | U1.31 45.97,7.63 45.59,8 45.59,10.16 | 45.59,10.16 46.1,10.67 46.86,10.67 | 55.47,18.51 U1.75 54.46,18.01 | U1.65 54.54,14.01 54.39,13.86 54.39,13.63 54.1,13.34 49.91,13.34 | 54.46,18.01 54.46,18.68 | 89.41,25.91 89.41,23.37 | 84.33,25.91 84.33,23.37 | 5.59,0.51 5.59,2.41 6.22,3.05 | 0.51,3.05 2.29,3.05 2.92,3.68 | U1.45 51.57,4.69 51.69,4.57 | 62.36,4.06 54.48,4.06
  Top 0.254: C9.2 35.42,14.34 35.81,14.73 37.34,14.73 37.72,14.35 37.72,13.08 38.1,12.7 | C7.2 46.86,3.68 46.86,4.45 | 51.69,4.57 53.98,4.57 54.48,4.06 56.39,4.06 56.02,4.43 C11.2 | C6.2 50.69,22.75 51.31,23.37 51.31,25.91 | 51.31,25.91 69.09,25.91 | 69.09,25.91 69.09,23.75 | 5.59,25.91 0.51,25.91 0.51,17.02 | 5.59,25.91 10.67,25.91 | 10.67,25.91 51.31,25.91 | 0.51,5.59 0.51,3.05 0.51,0.51 5.59,0.51 8.13,0.51 | 0.51,5.59 0.51,17.02 | 8.13,0.51 15.75,0.51 | 15.75,0.51 46.23,0.51 | 46.23,0.51 64.01,0.51 | 64.01,0.51 74.17,0.51 | 74.17,0.51 102.36,0.51 | 69.09,25.91 71.63,25.91 | 71.63,25.91 74.17,25.91 | 74.17,25.91 84.33,25.91 89.41,25.91 102.62,25.91 | 46.23,0.51 46.23,2.79 | 64.01,0.51 64.01,2.41 62.36,4.06 | 5.59,25.91 5.59,23.75 | 0.51,17.02 1.91,17.02 | 0.51,5.59 2.67,5.59 | 8.13,0.51 8.13,3.17 | 15.75,0.51 15.75,2.54 | 74.17,0.51 74.17,2.54 | 10.67,25.91 10.67,24 | 71.63,25.91 71.63,23.75 | 74.17,25.91 74.17,23.62 | 71.75,8 76.71,8 | 76.71,8 77.6,8 | 76.71,8 C2.2
  Bottom 0.254: v101.73,9.52 102.41,10.21 J7.GND
  Bottom 0.406: v67.82,10.92 67.82,11.94 69.09,13.21 72.26,13.21 v72.64,12.83
  pour Top (isolate 0.305, rank 2): 0.51,25.91 0.51,0.51 111,0.51 111,25.91
N$1
  Top 0.406: J2.2 98.57,18.56 J1.2 95.5,15.49 95.5,8 94.49,6.99 93.34,6.99 91.31,9.02 91.31,10.91 D1.A
N$2
  Top 0.406: PWR_SEL.2 PWR_SEL.5 85.72,13.46 84.48,12.22 F1.1
N$3
  Top 0.254: R13.2 72.25,15.75 R14.2 70.51,15.25 U2.1
N$4
  Top 0.254: 74.4,12.47 U3.1 74.42,12.62 74.42,11.3 74.17,11.05 R15.2 74.17,10.03 74.8,9.4 74.8,9.38 R16.2
N$6
  Top 0.254: R11.1 33.02,8.76 31.63,7.38 PWR.A
N$20
  Top 0.254: USB.A 16.39,7.38 17.78,8.76 17.65,8.76 17.67,8.78 R8.1
N$22
  Top 0.254: R7.1 21.59,8.76 20.2,7.38 LED1.A
N$23
  Top 0.254: R6.1 25.4,8.76 24.02,7.38 LED2.A
N$35
  Top 0.254: R4.1 29.21,8.76 27.82,7.38 LED3.A
N$110  (via drill 0.38)
  Top 0.203: U1.85 49.97,17.96 49.4,17.4 49.4,16.89 v48.64,16.13 | C5.A 58.67,19.68 v56.77,19.68 56.77,19.83 C4.1
  Bottom 0.203: v48.64,16.13 48.64,15.88 49.66,14.86 50.55,14.86 51.05,15.37 52.45,15.37 v56.77,19.68
OSC1
  Top 0.203: U1.63 58.67,13.21 59.18,12.7
  Top 0.254: 59.18,12.7 59.18,11.43 59.94,10.67 60.77,10.67 Q1.1 62.12,8.32 C14.2
OSC2
  Top 0.203: U1.64 59.23,13.61 Q1.3
  Top 0.254: Q1.3 60.32,13.98 C15.2
PGC  (via drill 0.38)
  Top 0.203: U1.26 43.92,6.5 v43.05,7.37
  Bottom 0.254: J5.5 3.05,10.67 3.05,8.51 4.06,7.49 38.61,7.49 38.86,7.75 42.67,7.75 v43.05,7.37
PGD  (via drill 0.38)
  Top 0.203: U1.27 44.37,7.92 44.07,8.22 v44.07,8.25
  Bottom 0.254: v44.07,8.25 38.61,8.25 38.35,8 4.32,8 3.56,8.76 3.56,12.7 J5.4
RA0
  Top 0.203: U1.17 38.79,11.61 33.27,6.1
  Top 0.254: 33.27,6.1 30.23,6.1 29.21,5.08 27.43,5.08 26.92,4.57 25.15,4.57 24.64,4.06 22.86,4.06 22.35,3.56 20.57,3.56 20.07,3.05 18.29,3.05 J4.7
RA1
  Top 0.203: U1.38 48.77,5.33 48.9,5.21 48.9,2.79 47.88,1.78 J4.19
RA2  (via drill 0.38)
  Top 0.203: U1.58 56.39,11.21 56.61,10.98 56.61,10.07 57.91,8.76 58.67,8.76 v58.93,8.51
  Bottom 0.254: v58.93,8.51 59.69,7.75 60.33,7.75 62.48,5.59 75.18,5.59 77.72,3.05 79.25,3.05 J4.32
RA3  (via drill 0.38)
  Top 0.203: U1.59 56.59,11.61 57.15,11.05 57.15,10.67 v57.79,10.03
  Bottom 0.254: J4.33 81.28,3.56 77.98,3.56 75.44,6.1 62.74,6.1 59.31,9.52 58.29,9.52 v57.79,10.03
RA4  (via drill 0.38)
  Top 0.203: U1.60 57.08,12.01 v57.91,11.18
  Bottom 0.254: J4.34 83.31,4.06 78.23,4.06 75.69,6.6 64.26,6.6 60.33,10.54 58.55,10.54 v57.91,11.18
RA5  (via drill 0.38)
  Top 0.203: U1.61 57.95,12.41 v58.04,12.32
  Bottom 0.254: v58.04,12.32 59.31,12.32 64.52,7.11 75.95,7.11 78.49,4.57 83.69,4.57 85.09,3.17 86.23,3.17 87.63,1.78 J4.35
RA6  (via drill 0.38)
  Top 0.203: U1.91 47.57,21.77 v46.74,22.61
  Bottom 0.254: v46.74,22.61 44.45,22.61 J3.24
RA7  (via drill 0.38)
  Top 0.203: U1.92 47.17,21.03 v46.74,21.46
  Bottom 0.254: v46.74,21.46 46.23,21.97 42.55,21.97 J3.25
RA9
  Top 0.203: U1.28 44.77,5.4 43.94,4.57
  Top 0.254: 43.94,4.57 36.83,4.57 35.31,3.05 33.53,3.05 J4.13
RA10
  Top 0.203: U1.29 45.17,5.04 44.2,4.06
  Top 0.254: 44.2,4.06 37.08,4.06 J4.14
RA14  (via drill 0.38)
  Top 0.203: U1.66 58.35,14.41 v58.42,14.48
  Top 0.254: J4.36 89.41,3.05 84.07,3.05 82.8,4.32 81.03,4.32 80.39,4.95 79.63,4.95 78.99,5.59 v78.61,5.59
  Bottom 0.254: v58.42,14.48 58.42,14.1 64.52,8 76.58,8 78.61,5.97 v78.61,5.59
RA15  (via drill 0.38)
  Top 0.203: U1.67 57.23,14.81 57.66,15.24 58.8,15.24 v59.56,14.48
  Top 0.254: J4.37 91.44,3.56 84.33,3.56 83.06,4.83 81.28,4.83 80.64,5.46 80.01,5.46 79.25,6.22 v79.25,8
  Bottom 0.254: v59.56,14.48 59.56,13.84 64.9,8.51 78.74,8.51 v79.25,8
RB0  (via drill 0.38)
  Top 0.203: U1.25 42.07,6.45 v42.16,6.35
  Bottom 0.254: J5.8 1.78,4.95 2.79,5.97 38.1,5.97 38.61,5.46 41.66,5.46 42.16,5.97 v42.16,6.35
RB1  (via drill 0.38)
  Top 0.203: U1.24 41.22,8.81 40.77,8.36 v40.77,6.35
  Bottom 0.254: v40.77,6.35 40.39,5.97 39.12,5.97 38.61,6.48 2.16,6.48 J5.7
RB2  (via drill 0.38)
  Top 0.203: U1.23 40.96,9.21 39.62,7.87 v39.62,6.86
  Bottom 0.254: v39.62,6.86 39.5,6.99 3.81,6.99 1.78,9.02 J5.6
RB3
  Top 0.203: U1.22 40.6,9.61 34.54,3.56
  Top 0.254: 34.54,3.56 31.5,3.56 J4.12
RB4
  Top 0.203: U1.21 40.23,10.01 34.29,4.06
  Top 0.254: 34.29,4.06 31.24,4.06 30.23,3.05 28.45,3.05 J4.11
RB5
  Top 0.203: U1.20 39.87,10.41 34.04,4.57
  Top 0.254: 34.04,4.57 30.99,4.57 29.97,3.56 28.19,3.56 27.69,3.05 25.91,3.05 J4.10
RB8
  Top 0.203: U1.32 46.37,5.47 44.45,3.56
  Top 0.254: 44.45,3.56 39.12,3.56 J4.15
RB9
  Top 0.203: U1.33 46.77,5.11 44.7,3.05
  Top 0.254: 44.7,3.05 41.15,3.05 J4.16
RB10  (via drill 0.38)
  Top 0.203: U1.34 47.17,7.7 v46.48,8.38
  Bottom 0.254: J4.17 42.42,3.94 46.48,8 v46.48,8.38
RB11  (via drill 0.38)
  Top 0.203: U1.35 47.57,8.57 v46.48,9.65
  Bottom 0.254: v46.48,9.65 47.37,8.76 47.37,7.87 44.96,5.46 J4.18
RB12
  Top 0.203: U1.41 49.97,3.88 50.8,3.05
  Top 0.254: 50.8,3.05 53.21,3.05 54.48,1.78 J4.22
RB13  (via drill 0.38)
  Top 0.203: U1.42 50.37,8.18 v49.28,9.27
  Bottom 0.254: J4.23 57.15,1.78 50.04,8.89 49.66,9.27 v49.28,9.27
RB14
  Top 0.203: U1.43 50.77,3.84 51.05,3.56
  Top 0.254: 51.05,3.56 53.47,3.56 53.98,3.05 58.93,3.05 J4.24
RB15
  Top 0.203: U1.44 51.17,4.2 51.31,4.06
  Top 0.254: 51.31,4.06 53.72,4.06 54.23,3.56 60.96,3.56 J4.25
RC1  (via drill 0.38)
  Top 0.203: U1.6 40,16.01 38.73,17.27 v38.73,17.91
  Bottom 0.254: J3.38 6.86,22.86 9.27,20.45 11.05,20.45 19.3,20.45 19.81,19.94 36.7,19.94 v38.73,17.91
RC2  (via drill 0.38)
  Top 0.203: U1.7 39.64,15.61 37.59,17.65
  Top 0.254: v37.47,17.91 37.47,17.78 37.59,17.65
  Bottom 0.254: J3.39 9.02,19.94 19.05,19.94 19.56,19.43 35.94,19.43 v37.47,17.91
RC3  (via drill 0.38)
  Top 0.203: U1.8 38.89,15.21 v36.2,17.91
  Bottom 0.254: v36.2,17.91 35.18,18.92 19.3,18.92 18.8,19.43 6.99,19.43 J3.40
RC4  (via drill 0.38, 0.38 pad 0.25)
  Top 0.203: U1.9 39.83,14.81 v38.73,13.72
  Top 0.254: J4.1 4.32,4.32 4.32,9.14 v5.84,10.67
  Bottom 0.254: v38.73,13.72 36.07,11.05 13.08,11.05 12.32,11.81 6.99,11.81 v5.84,10.67
RC13  (via drill 0.38)
  Top 0.203: U1.73 54.55,17.21 53.85,16.51 53.85,16.26 52.45,14.86 51.82,14.86 v51.05,14.1 | C17.1 Q2.X1 67.69,20.83 68.07,20.45 v71.12,20.45
  Bottom 0.203: 59.82,19.68 58.93,18.8 56.52,18.8 52.58,14.86 51.82,14.86 v51.05,14.1 | 71.12,19.68 v71.12,20.45 | 75.56,19.68 J3.9
  Bottom 0.254: 59.82,19.68 71.12,19.68 75.56,19.68
RC14
  Top 0.203: 66.55,17.53 56.52,17.53 56.43,17.61 U1.74 | C16.1 Q2.X2 66.55,17.53 | 66.55,17.53 67.44,17.53
  Top 0.254: 67.44,17.53 69.34,19.43 71.5,19.43 74.17,22.1 75.44,22.1 J3.10
RD0
  Top 0.203: U1.72 56.56,16.81 56.81,17.06
  Top 0.254: 56.81,17.06 67.73,17.06 69.6,18.92 71.75,18.92 74.42,21.59 75.69,21.59 77.47,23.37 81.79,23.37 J3.8
RD1  (via drill 0.38)
  Top 0.203: v54.86,19.56 54.1,19.56 53.75,19.91 U1.76
  Bottom 0.203: J3.11 74.8,24.64 73.53,23.37 71.63,23.37 69.09,20.83 55.63,20.83 54.86,20.07 v54.86,19.56
RD2  (via drill 0.38)
  Top 0.203: U1.77 53.17,18.71 53.47,18.41 v53.59,18.41
  Bottom 0.203: J3.12 72.14,24.64 68.83,21.34 55.25,21.34 53.59,19.68 v53.59,18.41
RD3  (via drill 0.38)
  Top 0.203: U1.78 52.77,17.21 v51.69,16.13
  Bottom 0.203: v51.69,16.13 52.83,17.27 52.83,19.56 55.12,21.84 67.56,21.84 J3.13
RD4
  Top 0.203: U1.81 51.57,21.85 52.58,22.86
  Top 0.254: 52.58,22.86 58.55,22.86 59.05,23.37 60.83,23.37 62.1,24.64 J3.16
RD5
  Top 0.203: U1.82 51.17,22.21 52.32,23.37
  Top 0.254: 52.32,23.37 58.29,23.37 59.56,24.64 J3.17
RD6  (via drill 0.38)
  Top 0.203: v49.91,15.75 50.16,15.75 50.93,16.51 50.93,17.27 50.77,17.43 U1.83
  Bottom 0.203: v49.91,15.75 50.16,15.75 50.93,16.51 50.93,17.27 50.8,17.4 50.8,19.43 54.74,23.37 57.15,23.37 57.66,23.88
  Bottom 0.254: 57.66,23.88 J3.18
RD7  (via drill 0.38)
  Top 0.203: U1.84 50.37,17.07 50.19,16.89 v50.16,16.89
  Bottom 0.203: v50.16,16.89 50.16,19.56 55.12,24.51
  Bottom 0.254: 55.12,24.51 J3.19
RD8
  Top 0.203: U1.68 56.48,15.21 57.25,15.97
  Top 0.254: 57.25,15.97 68.17,15.97 70.1,17.91 72.26,17.91 74.93,20.57 76.2,20.57 77.98,22.35 90.93,22.35 J3.4
RD9  (via drill 0.38)
  Top 0.203: v53.72,14.22 53.72,14.86 54.47,15.61 U1.69
  Bottom 0.203: v53.72,14.22 53.72,14.73 56.97,17.98 59.64,17.98 60.33,18.67
  Bottom 0.254: 60.33,18.67 80.39,18.67 85.09,23.37 89.41,23.37 J3.5
RD10
  Top 0.203: U1.70 56.52,16.01 57.03,16.52
  Top 0.254: 57.03,16.52 67.95,16.52 69.85,18.41 72.01,18.41 74.68,21.08 75.95,21.08 77.72,22.86 86.36,22.86 J3.6
RD11  (via drill 0.38)
  Top 0.203: U1.71 54.51,16.41 54.36,16.26 54.36,16.13 v52.32,14.1
  Bottom 0.203: v52.32,14.1 52.45,14.1 56.74,18.39 59.28,18.39 60.07,19.18
  Bottom 0.254: 60.07,19.18 80.14,19.18 J3.7
RD12  (via drill 0.38)
  Top 0.203: U1.79 52.37,17.95 v51.69,17.27
  Bottom 0.203: v51.69,17.27 52.32,17.91 52.32,19.68 54.99,22.35 65.53,22.35 J3.14
RD13  (via drill 0.38)
  Top 0.203: U1.80 51.97,18.82 v51.56,18.41
  Bottom 0.203: v51.56,18.41 51.56,19.56 54.86,22.86 63.5,22.86 J3.15
RD14  (via drill 0.38)
  Top 0.203: v51.05,9.65 51.05,9.02 52.37,7.7 U1.47
  Bottom 0.254: J4.26 64.01,3.05 56.9,3.05 51.05,8.89 v51.05,9.65
RD15  (via drill 0.38)
  Top 0.203: U1.48 52.77,8.06 52.2,8.64 v52.2,9.14
  Bottom 0.254: v52.2,9.14 52.2,8.51 57.15,3.56 66.04,3.56 J4.27
RE0  (via drill 0.38)
  Top 0.203: U1.93 46.77,17.18 v46.61,17.02
  Top 0.254: v19.05,13.84 19.05,10.92 19.81,10.16 23.88,10.16 24.51,9.52 27.18,9.52 27.69,9.02 LED3.C
  Bottom 0.254: v19.05,13.84 19.05,15.24 20.57,16.76 33.78,16.76 35.05,15.49 45.34,15.49 46.61,16.76 v46.61,17.02 46.61,18.54 44.45,20.7 41.28,20.7 39.5,20.7 37.34,22.86 J3.26
RE1  (via drill 0.38)
  Top 0.203: U1.94 46.37,18.68 v45.72,18.03
  Top 0.254: v18.16,12.95 18.16,11.05 19.56,9.65 23.11,9.65 23.88,8.89 LED2.C
  Bottom 0.254: v18.16,12.95 18.16,15.24 20.19,17.27 34.04,17.27 35.31,16 44.96,16 45.72,16.76 v45.72,18.03 43.82,19.94 39.5,19.94 J3.27
RE2  (via drill 0.38)
  Top 0.203: 44.45,21.59 44.77,21.27 U1.98 44.77,17.08
  Top 0.254: 44.45,21.59 27.69,21.59 J3.31 | v44.83,17.14 44.77,17.08 | v17.27,13.84 17.27,10.92 19.3,8.89 20.19,8.89 20.18,8.88 LED1.C
  Bottom 0.254: v44.83,17.14 44.2,16.51 35.56,16.51 34.29,17.78 19.68,17.78 17.27,15.37 v17.27,13.84
RE3  (via drill 0.38)
  Top 0.203: 25.65,21.08 44.2,21.08 44.37,20.91 U1.99 44.37,18.46 v43.94,18.03
  Top 0.254: 25.65,21.08 J3.32 | v16.38,12.95 16.38,9.27 16.26,9.14 USB.C
  Bottom 0.254: v43.94,18.03 42.93,17.02 35.81,17.02 34.54,18.29 19.3,18.29 16.38,15.37 v16.38,12.95
RE4
  Top 0.203: U1.100 43.97,20.17 43.69,20.45 25.53,20.45
  Top 0.254: J3.33 20.83,23.37 22.61,23.37 25.53,20.45
RE5
  Top 0.203: U1.3 41.09,17.21 40.77,17.53 40.77,18.67
  Top 0.254: J3.35 15.75,23.37 20.07,23.37 20.57,22.86 22.35,22.86 25.27,19.94 39.5,19.94 40.77,18.67
RE6  (via drill 0.38)
  Top 0.203: U1.4 40.72,16.81 40.26,17.27 40.26,18.41
  Top 0.254: 24.26,20.19 22.1,22.35 20.32,22.35 19.81,22.86 13.72,22.86 J3.36 | 24.26,20.19 25.02,19.43 39.24,19.43 40.26,18.41 | 24.26,20.19 USER.3 USER.4 15.62,20.19 15.11,19.68 v15.11,17.53 | v14.22,14.86 14.21,14.86 R5.2
  Bottom 0.254: v15.11,17.53 15.11,15.75 v14.22,14.86
RE7  (via drill 0.38)
  Top 0.203: U1.5 40.36,16.41 39.75,17.02 39.75,18.16
  Top 0.254: 9.4,20.19 PROGRAM.4 8.13,23.37 J3.37 | 9.4,20.19 PROGRAM.3 | 39.75,18.16 38.99,18.92 17.02,18.92 v16.51,18.41 | v9.4,18.41 9.4,20.19 | R3.2 11.54,13.86 v11.94,13.46
  Bottom 0.254: v16.51,18.41 v9.4,18.41 9.4,18.29 11.94,15.75 v11.94,13.46
RE8
  Top 0.203: U1.18 39.15,11.21 33.53,5.59
  Top 0.254: 33.53,5.59 30.48,5.59 29.46,4.57 27.69,4.57 27.18,4.06 25.4,4.06 24.89,3.56 23.11,3.56 22.61,3.05 20.83,3.05 J4.8
RE9
  Top 0.203: U1.19 39.51,10.81 33.78,5.08
  Top 0.254: 33.78,5.08 30.73,5.08 29.72,4.06 27.94,4.06 27.43,3.56 25.65,3.56 25.15,3.05 23.37,3.05 J4.9
RF0  (via drill 0.38)
  Top 0.203: U1.87 49.17,18.94 v48.64,18.41
  Bottom 0.254: J3.20 51.94,24.64 50.67,23.37 49.28,23.37 48.64,22.73 v48.64,18.41
RF1
  Top 0.203: U1.88 48.77,23.37 J3.21
RF2  (via drill 0.38)
  Top 0.203: U1.52 56.47,8.81 56.77,8.51 56.77,7.87 v56.52,7.62
  Bottom 0.254: v56.52,7.62 57.4,6.73 59.82,6.73 61.98,4.57 72.64,4.57 J4.30
RF4  (via drill 0.38)
  Top 0.203: U1.49 53.17,7.45 53.34,7.62 54.36,7.62 v54.61,7.37
  Bottom 0.254: v54.61,7.37 57.91,4.06 68.07,4.06 J4.28
RF5
  Top 0.203: U1.50 53.85,6.22
  Top 0.254: J4.29 71.63,3.05 64.14,3.05 62.48,4.7 58.8,4.7 57.28,6.22 53.85,6.22
RF8  (via drill 0.38)
  Top 0.203: U1.53 56.83,9.21 57.79,8.25 v57.79,7.87
  Bottom 0.254: v57.79,7.87 58.42,7.24 60.07,7.24 62.23,5.08 74.93,5.08 77.98,2.03 J4.31
RF12  (via drill 0.38)
  Top 0.203: U1.40 49.57,7.71 v49.28,8
  Bottom 0.254: J4.21 52.58,5.08 49.66,8 v49.28,8
RF13
  Top 0.203: U1.39 49.17,5.57 49.4,5.33 49.4,2.41 J4.20
RG0
  Top 0.203: J3.23 45.59,24.64 46.86,23.37 47.12,23.37 47.97,22.52 U1.90
RG1
  Top 0.203: U1.89 48.37,23.77 J3.22
RG6  (via drill 0.38)
  Top 0.203: U1.10 46.54,14.41 v46.99,14.86
  Top 0.254: v5.59,8.89 5.59,3.05 J4.2
  Bottom 0.254: v5.59,8.89 8,11.3 12.07,11.3 12.83,10.54 37.08,10.54 41.02,14.48 46.61,14.48 v46.99,14.86
RG7  (via drill 0.38)
  Top 0.203: U1.11 47.97,14.01 v48.01,13.97
  Top 0.254: J4.3 v6.86,8.89
  Bottom 0.254: v6.86,8.89 8.76,10.8 11.81,10.8 12.57,10.03 37.34,10.03 41.28,13.97 v48.01,13.97
RG8  (via drill 0.38)
  Top 0.203: U1.12 46.59,13.61 v47.12,13.08
  Top 0.254: J4.4 9.65,2.03 9.65,7.49 v8.25,8.89
  Bottom 0.254: v8.25,8.89 9.65,10.29 11.56,10.29 12.32,9.52 37.59,9.52 41.53,13.46 46.74,13.46 v47.12,13.08
RG9  (via drill 0.38)
  Top 0.203: U1.14 44.85,12.81 v45.59,12.07
  Top 0.254: J4.6 10.92,5.33 v10.92,8.89
  Bottom 0.254: v10.92,8.89 11.3,8.51 38.1,8.51 41.91,12.32 45.34,12.32 v45.59,12.07
RG12
  Top 0.203: U1.96 45.57,22 44.96,22.61
  Top 0.254: 44.96,22.61 31.75,22.61 J3.29
RG13
  Top 0.203: U1.97 45.17,21.63 44.7,22.1
  Top 0.254: 44.7,22.1 29.72,22.1 J3.30
RG14
  Top 0.203: U1.95 45.97,22.36 45.21,23.11
  Top 0.254: 45.21,23.11 33.78,23.11 J3.28
RG15  (via drill 0.38)
  Top 0.203: v41.66,18.92 41.66,18.41 U1.1
  Bottom 0.254: J3.34 21.21,20.45 37.08,20.45 38.1,19.43 41.15,19.43 v41.66,18.92
USBID  (via drill 0.38)
  Top 0.203: 55.47,7.27 U1.51 54.51,8.41 54.36,8.25 53.47,8.25 53.09,8.64 53.09,9.78 52.83,10.03 52.07,10.03 51.56,10.54 v51.56,11.94 | 58.29,6.73 R9.1
  Top 0.254: 58.29,6.73 56.01,6.73 55.47,7.27 | J8.ID 102.07,7.66 100.2,9.52 v99.19,9.52
  Bottom 0.203: 66.67,17.02 66.12,17.58 57.2,17.58 54.74,15.11 54.74,13.46 54.1,12.83 51.82,12.83 51.56,12.57 v51.56,11.94
  Bottom 0.254: 66.67,17.02 82.55,17.02 83.95,18.41 91.82,18.41 J6.4 95.12,15.11 95.12,12.19 97.79,9.52 v99.19,9.52
VBUS  (via drill 0.38)
  Top 0.203: U1.54 54.44,9.61 v53.98,9.14
  Top 0.254: 88.27,14.48 88.14,14.48 88.17,14.45 PWR_SEL.6 88.27,14.48 | 88.27,14.48 88.22,14.52 | 88.27,14.48 88.27,14.35 | C3.1 99.31,5.84 | 88.39,14.22 88.77,14.22 v89.41,13.59
  Top 0.406: 88.22,14.52 PWR_SEL.3 | J8.VBUS 101.42,5.26 100.84,5.84 C3.1 99.33,4.81 v99.57,4.57 | PWR_SEL.6 88.32,14.35 88.39,14.35 88.39,14.22
  Bottom 0.254: v53.98,9.14 57.15,12.32 57.15,14.35 58.17,15.37 59.94,15.37 60.58,14.73 60.58,13.72 63.75,10.54 66.17,10.54 66.93,9.78 90.3,9.78
  Bottom 0.406: 99.57,5.84 96.77,5.84 J6.1 90.68,9.4 | J7.VBUS 107.24,16.21 108.33,15.11 108.33,10.03 104.14,5.84 99.57,5.84 | 99.57,5.84 v99.57,4.57 | 90.68,9.4 JP1.2 | v89.41,13.59 89.41,10.67 90.3,9.78 90.68,9.4
VIN_RAW  (via drill 0.38)
  Top 0.254: 79.45,12.65 U3.3 78.99,12.62 78.99,9.4 78.36,8.76 78.36,7.87 77.98,7.49 76.2,7.49 75.57,6.86 C1.A | C1.A arc90 C1.A
  Top 0.406: v87.63,12.45 87.61,12.42 87.61,11.78 D1.C | 79.45,12.65 v80.52,13.72
  Bottom 0.406: v87.63,12.45 81.79,12.45 v80.52,13.72
VPP  (via drill 0.38)
  Top 0.203: U1.13 45.72,13.21 46.86,12.07 v48.01,12.07
  Top 0.254: 9.65,10.03 RESET.4 8,10.03 8.13,10.16 R10.2 8.13,12.57 7.24,12.57 6.35,13.46 v6.35,17.53 | 9.65,10.03 RESET.3 | 9.65,10.03 v9.65,8.89 10.29,8.25 10.29,3.43 J4.5
  Bottom 0.254: v9.65,8.89 9.65,9.4 10.03,9.78 11.3,9.78 12.07,9.02 37.85,9.02 41.78,12.95 45.97,12.95 46.86,12.07 v48.01,12.07 | v6.35,17.53 J5.1

### Text on the board
Bottom: 4/1/2010
tPlace: v26 | C2 | C1 | E7 | E6 | E5 | G15 | E4 | E3 | E2 | G13 | G12 | G14 | E1 | E0 | A7 | A6 | G0 | G1 | F1 | F0 | D7 | D6 | D5 | D4 | D3 | D2 | D1 | C14 | C13 | D0 | D11 | D10 | D9 | D8 | 3.3V | 5V | GND | C3 | \D13 | D12 | VPP | - | 3.3V | MX460 | GND | + | GND | 32KHz | ID | EXT | USB | J1 | PROG | USER | J2 | PGD | J6 | D+ | PGC | PWR_SEL | D- | RESET | 8MHz | B2 | 3.3 | 5 | GND | Host | VBUS | B1 | USB | LED1 | LED2 | LED3 | PWR | JP1 | schmalzhaus.com/UBW32 | USB | B0 | A1 | 4 | A1 | 5 | G6 | G7 | G8 | VPP | G9 | A0 | E8 | E9 | B5 | B4 | B3 | A9 | A10 | B8 | B9 | B10 | B11 | F13 | F12 | B12 | B13 | B14 | B15 | D14 | D15 | F4 | F5 | F2 | F8 | A2 | A3 | A4 | A5 | A1 | 3.3V | 5V | GND | C4 | J8
bPlace: USB | ICSP | - | GND | + | ID | J1 | J6 | D+ | J7 | D- | WWW.SCHMALZHAUS.COM/UBW32 | 3.3 | 5 | GND | Host | VBUS | JP1
tValues: LM1117 | LM1117